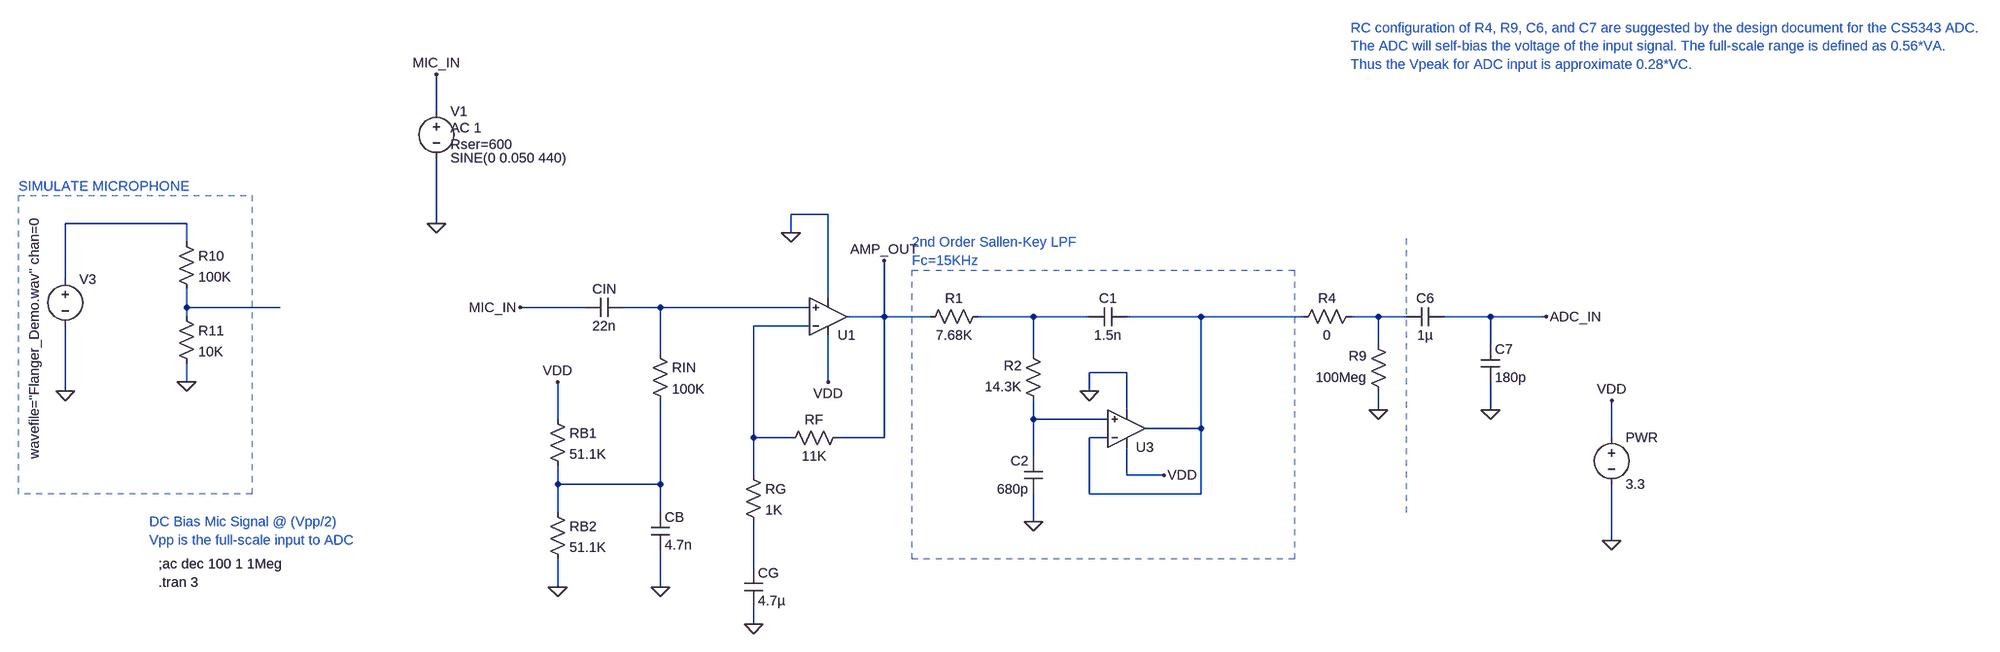
[diagram p0: schematic Input_Signal_Conditioner.asc]
Input_Signal_Conditioner.asc, the LTspice schematic file:
Version 4
SHEET 1 2260 864
WIRE -784 -208 -784 -272
WIRE -112 -32 -176 -32
WIRE -1216 -16 -1424 -16
WIRE -784 -16 -784 -128
WIRE -784 -16 -800 -16
WIRE -176 0 -176 -32
WIRE -1216 16 -1216 -16
WIRE -1424 80 -1424 -16
WIRE -112 112 -112 -32
WIRE -1216 128 -1216 96
WIRE -1056 128 -1216 128
WIRE -528 128 -640 128
WIRE -400 128 -464 128
WIRE -144 128 -400 128
WIRE -1216 144 -1216 128
WIRE -16 144 -16 48
WIRE -16 144 -80 144
WIRE 64 144 -16 144
WIRE 240 144 144 144
WIRE 336 144 240 144
WIRE 528 144 400 144
WIRE 704 144 528 144
WIRE 832 144 784 144
WIRE 880 144 832 144
WIRE 1024 144 944 144
WIRE 1120 144 1024 144
WIRE -144 160 -240 160
WIRE 832 192 832 144
WIRE 1024 192 1024 144
WIRE -400 208 -400 128
WIRE 240 208 240 144
WIRE 400 240 336 240
WIRE -1216 256 -1216 224
WIRE -112 256 -112 176
WIRE -1424 272 -1424 160
WIRE 336 272 336 240
WIRE 400 304 400 240
WIRE 832 304 832 272
WIRE 1024 304 1024 256
WIRE -576 320 -576 256
WIRE 240 320 240 288
WIRE 368 320 240 320
WIRE 528 336 528 144
WIRE 528 336 432 336
WIRE -240 352 -240 160
WIRE -176 352 -240 352
WIRE -16 352 -16 144
WIRE -16 352 -96 352
WIRE 368 352 336 352
WIRE 1232 352 1232 288
WIRE 240 384 240 320
WIRE -240 416 -240 352
WIRE 400 416 400 368
WIRE 464 416 400 416
WIRE -576 432 -576 400
WIRE -400 432 -400 288
WIRE -400 432 -576 432
WIRE 336 448 336 352
WIRE 528 448 528 336
WIRE 528 448 336 448
WIRE -576 480 -576 432
WIRE -400 480 -400 432
WIRE 240 496 240 448
WIRE 1232 528 1232 432
WIRE -240 576 -240 496
WIRE -576 608 -576 560
WIRE -400 608 -400 544
WIRE -240 672 -240 640
FLAG 240 496 0
FLAG 1232 528 0
FLAG 1232 288 VDD
FLAG -240 672 0
FLAG -400 608 0
FLAG -576 608 0
FLAG -576 256 VDD
FLAG -640 128 MIC_IN
FLAG -16 48 AMP_OUT
FLAG 1024 304 0
FLAG 832 304 0
FLAG 1120 144 ADC_IN
FLAG 464 416 VDD
FLAG 336 272 0
FLAG -112 256 VDD
FLAG -176 0 0
FLAG -1424 272 0
FLAG -1216 256 0
FLAG -784 -16 0
FLAG -784 -272 MIC_IN
SYMBOL res 160 128 R90
WINDOW 0 0 56 VBottom 2
WINDOW 3 32 56 VTop 2
SYMATTR InstName R1
SYMATTR Value 7.68K
SYMBOL res 256 304 R180
WINDOW 0 36 76 Left 2
WINDOW 3 36 40 Left 2
SYMATTR InstName R2
SYMATTR Value 14.3K
SYMBOL cap 400 128 R90
WINDOW 0 0 32 VBottom 2
WINDOW 3 32 32 VTop 2
SYMATTR InstName C1
SYMATTR Value 1.5n
SYMBOL cap 256 448 R180
WINDOW 0 24 56 Left 2
WINDOW 3 24 8 Left 2
SYMATTR InstName C2
SYMATTR Value 680p
SYMBOL voltage 1232 336 R0
WINDOW 123 24 124 Left 2
WINDOW 39 0 0 Left 0
SYMATTR InstName PWR
SYMATTR Value 3.3
SYMBOL res -80 336 R90
WINDOW 0 0 56 VBottom 2
WINDOW 3 32 56 VTop 2
SYMATTR InstName RF
SYMATTR Value 11K
SYMBOL cap -256 576 R0
SYMATTR InstName CG
SYMATTR Value 4.7µ
SYMBOL res -416 192 R0
SYMATTR InstName RIN
SYMATTR Value 100K
SYMBOL res -592 304 R0
SYMATTR InstName RB1
SYMATTR Value 51.1K
SYMBOL res -592 464 R0
SYMATTR InstName RB2
SYMATTR Value 51.1K
SYMBOL cap -416 480 R0
SYMATTR InstName CB
SYMATTR Value 4.7n
SYMBOL cap -464 112 R90
WINDOW 0 0 32 VBottom 2
WINDOW 3 32 32 VTop 2
SYMATTR InstName CIN
SYMATTR Value 22n
SYMBOL res -256 400 R0
SYMATTR InstName RG
SYMATTR Value 1K
SYMBOL cap 944 128 R90
WINDOW 0 0 32 VBottom 2
WINDOW 3 32 32 VTop 2
SYMATTR InstName C6
SYMATTR Value 1µ
SYMBOL cap 1008 192 R0
SYMATTR InstName C7
SYMATTR Value 180p
SYMBOL res 800 128 R90
WINDOW 0 0 56 VBottom 2
WINDOW 3 32 56 VTop 2
SYMATTR InstName R4
SYMATTR Value 0
SYMBOL res 848 288 R180
WINDOW 0 36 76 Left 2
WINDOW 3 36 40 Left 2
SYMATTR InstName R9
SYMATTR Value 100Meg
SYMBOL OpAmps\\UniversalOpamp2 -112 144 M180
SYMATTR InstName U1
SYMATTR Value2 Avol=316227 GBW=2Meg Slew=1Meg
SYMBOL voltage -1424 64 R0
WINDOW 3 -53 -90 VRight 2
SYMATTR Value wavefile="Flanger_Demo.wav" chan=0
SYMATTR InstName V3
SYMATTR Value2 AC 9.0909
SYMBOL res -1232 0 R0
SYMATTR InstName R10
SYMATTR Value 100K
SYMBOL res -1232 128 R0
SYMATTR InstName R11
SYMATTR Value 10K
SYMBOL OpAmps\\UniversalOpamp2 400 336 M180
SYMATTR InstName U3
SYMBOL voltage -784 -224 R0
WINDOW 123 24 44 Left 2
WINDOW 39 24 72 Left 2
SYMATTR InstName V1
SYMATTR Value SINE(0 0.050 440)
SYMATTR Value2 AC 1
SYMATTR SpiceLine Rser=600
TEXT 32 16 Left 2 ;2nd Order Sallen-Key LPF\nFc=15KHz
TEXT -1280 496 Left 2 ;DC Bias Mic Signal @ (Vpp/2)\nVpp is the full-scale input to ADC
TEXT 784 -352 Left 2 ;RC configuration of R4, R9, C6, and C7 are suggested by the design document for the CS5343 ADC.\nThe ADC will self-bias the voltage of the input signal. The full-scale range is defined as 0.56*VA.\nThus the Vpeak for ADC input is approximate 0.28*VC.
TEXT -1264 568 Left 2 !;ac dec 100 1 1Meg
TEXT -1504 -80 Left 2 ;SIMULATE MICROPHONE
TEXT -1264 600 Left 2 !.tran 3
LINE Normal 880 480 880 0 4
RECTANGLE Normal 688 560 32 64 2
RECTANGLE Normal -1104 448 -1504 -64 2

The netlist it stands for:
* Input_Signal_Conditioner.asc
R1 N004 AMP_OUT 7.68K
R2 N008 N004 14.3K
C1 N005 N004 1.5n
C2 0 N008 680p
V§PWR VDD 0 3.3
RF AMP_OUT N007 11K
CG N010 0 4.7µ
RIN N003 N009 100K
RB1 VDD N009 51.1K
RB2 N009 0 51.1K
CB N009 0 4.7n
CIN N003 MIC_IN 22n
RG N007 N010 1K
C6 ADC_IN N006 1µ
C7 ADC_IN 0 180p
R4 N006 N005 0
R9 0 N006 100Meg
XU1 N003 N007 VDD 0 AMP_OUT level.2 Avol=316227 GBW=2Meg Slew=1Meg ilimit=25m rail=0 Vos=0 phimargin=45 en=0 enk=0 in=0 ink=0 Rin=500Meg  ; pins IN+ IN- V+ V- OUT
V3 N001 0 wavefile="Flanger_Demo.wav" chan=0 AC 9.0909
R10 N001 N002 100K
R11 N002 0 10K
XU3 N008 N005 VDD 0 N005 level.2 Avol=1Meg GBW=10Meg Slew=10Meg ilimit=25m rail=0 Vos=0 phimargin=45 en=0 enk=0 in=0 ink=0 Rin=500Meg  ; pins IN+ IN- V+ V- OUT
V1 MIC_IN 0 SINE(0 0.050 440) AC 1 Rser=600
* 2nd Order Sallen-Key LPF
* Fc=15KHz
* DC Bias Mic Signal @ (Vpp/2)
* Vpp is the full-scale input to ADC
* RC configuration of R4, R9, C6, and C7 are suggested by the design document for the CS5343 ADC.
* The ADC will self-bias the voltage of the input signal. The full-scale range is defined as 0.56*VA.
* Thus the Vpeak for ADC input is approximate 0.28*VC.
;ac dec 100 1 1Meg
* SIMULATE MICROPHONE
.tran 3
.lib UniversalOpamps2.sub
.backanno
.end